# Altium schematic sheet Sheet1.SchDoc
size A4; SheetNumber: 1; SheetTotal: 1
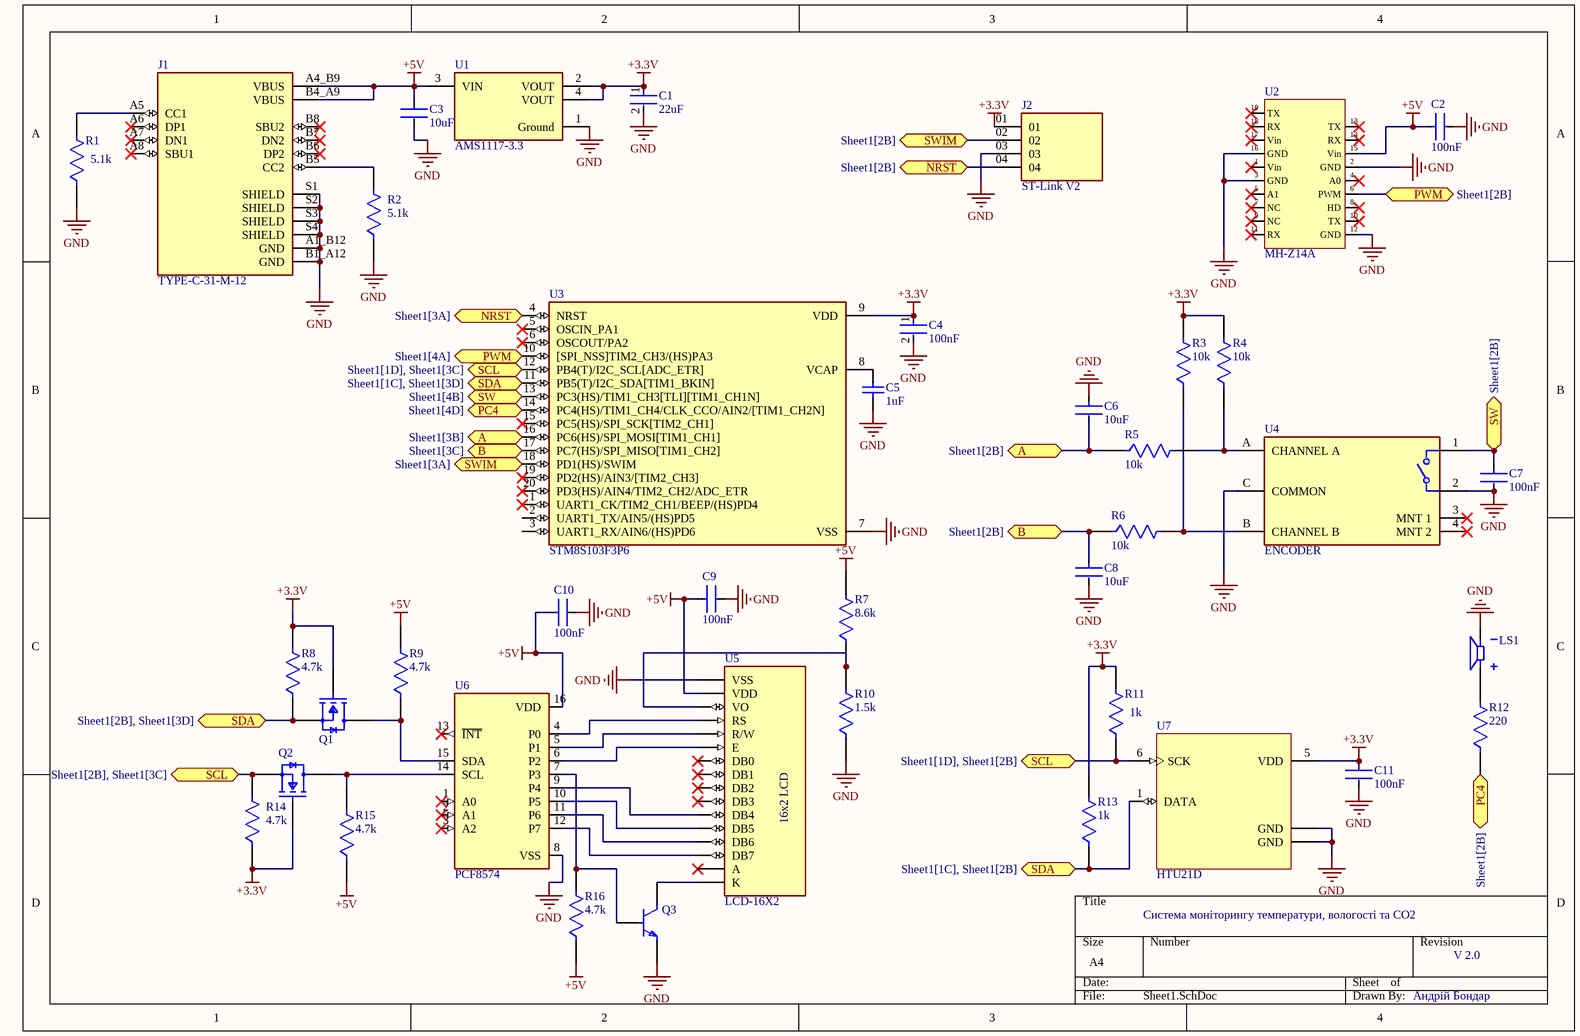
[diagram p0: Sheet1.SchDoc]

## Parts
C1  22uF  [FP-CGA5L-0_3-0_1-MFG]
C2  100nF  [FP-AC1206-0_85-MFG]
C3  10uF  [FP-C3216-160-0_2-IPC_B]
C4  100nF  [FP-AC1206-0_85-MFG]
C5  1uF  [CAPC1206(3216)150_L]
C6  10uF  [FP-C3216-160-0_2-IPC_B]
C7  100nF  [FP-AC1206-0_85-MFG]
C8  10uF  [FP-C3216-160-0_2-IPC_B]
C9  100nF  [FP-AC1206-0_85-MFG]
C10  100nF  [FP-AC1206-0_85-MFG]
C11  100nF  [FP-AC1206-0_85-MFG]
J1  TYPE-C-31-M-12  [HRO_TYPE-C-31-M-12]
J2  ST-Link V2  [SAMTEC_MTSW-104-07-G-S-200]
LS1  CPI-148-24-90T-67  [XDCR_CPI-148-24-90T-67]  (value not drawn)
Q1  BSS138  [FP-318-08-IPC_B]  (value not drawn)
Q2  BSS138  [FP-318-08-IPC_B]  (value not drawn)
Q3  SS8050DBU  [FP-135AN-MFG]  (value not drawn)
R1  5.1k  [FP-ESR18-IPC_A]
R2  5.1k  [FP-ESR18-IPC_A]
R3  10k  [FP-SR1206-MFG]
R4  10k  [FP-SR1206-MFG]
R5  10k  [FP-SR1206-MFG]
R6  10k  [FP-SR1206-MFG]
R7  8.6k  [FP-RP732B-MFG]
R8  4.7k  [FP-CRCW1206-Pe3-IPC_A]
R9  4.7k  [FP-CRCW1206-Pe3-IPC_A]
R10  1.5k  [FP-RMCF1206-MFG]
R11  1k  [FP-RMCF1206-IPC_A]
R12  220  [FP-SR1206-MFG]
R13  1k  [FP-RMCF1206-IPC_A]
R14  4.7k  [FP-CRCW1206-Pe3-IPC_A]
R15  4.7k  [FP-CRCW1206-Pe3-IPC_A]
R16  4.7k  [FP-CRCW1206-Pe3-IPC_A]
U1  AMS1117-3.3  [FP-AMS1117-IPC_C]
U2  MH-Z14A  [MH-Z14A]
U3  STM8S103F3P6  [SOP65P640X120-20N]
U4  ENCODER  [FP-PEC11R-4115F-S0018-MFG]
U5  LCD-16X2  [MODULE_LCD-16X2]
U6  PCF8574  [SOP65P640X150-20N]
U7  HTU21D  [QFN100P300X300X100-7N]

## Ports
A (bidir, see Sheet1[2B]), A (bidir, see Sheet1[3B]), B (bidir, see Sheet1[2B]), B (bidir, see Sheet1[3C]), NRST (bidir, see Sheet1[2B]), NRST (bidir, see Sheet1[3A]), PC4 (bidir, see Sheet1[2B]), PC4 (bidir, see Sheet1[4D]), PWM (bidir, see Sheet1[2B]), PWM (bidir, see Sheet1[4A]), SCL (bidir, see Sheet1[1D], Sheet1[2B]), SCL (bidir, see Sheet1[1D], Sheet1[3C]), SCL (bidir, see Sheet1[2B], Sheet1[3C]), SDA (bidir, see Sheet1[1C], Sheet1[2B]), SDA (bidir, see Sheet1[1C], Sheet1[3D]), SDA (bidir, see Sheet1[2B], Sheet1[3D]), SW (bidir, see Sheet1[2B]), SW (bidir, see Sheet1[4B]), SWIM (bidir, see Sheet1[2B]), SWIM (bidir, see Sheet1[3A])

## Nets
+3.3V: C1.1 C4.1 C11.1 J2.01 Q1.1(G) Q2.1(G) R3.2 R4.2 R8.2 R11.2 R13.2 R14.1 U1.2(VOUT) U1.4(VOUT) U3.9(VDD) U7.5(VDD)
+5V: C2.1 C3.1 C9.1 C10.1 J1.A4_B9(VBUS) J1.B4_A9(VBUS) R7.2 R9.2 R15.1 R16.1 U1.3(VIN) U2.15(Vin) U5.2(VDD) U6.16(VDD)
GND: C1.2 C2.2 C3.2 C4.2 C5.1 C6.1 C7.2 C8.2 C9.2 C10.2 C11.2 J1.A1_B12(GND) J1.B1_A12(GND) J1.S1(SHIELD) J1.S2(SHIELD) J1.S3(SHIELD) J1.S4(SHIELD) J2.03 LS1.N Q3.1(E) R1.1 R2.1 R10.1 U1.1(Ground) U2.2(GND) U2.3(GND) U2.12(GND) U2.16(GND) U3.7(VSS) U4.2 U4.C(COMMON) U5.1(VSS) U6.8(VSS) U7.2(GND) U7.PAD(GND)
A: C6.2 R5.1 U3.16(PC6(HS)/SPI_MOSI[TIM1_CH1]) ; port A
B: C8.1 R6.1 U3.17(PC7(HS)/SPI_MISO[TIM1_CH2]) ; port B
NRST: J2.04 U3.4(NRST) ; port NRST
PC4: R12.1 U3.14(PC4(HS)/TIM1_CH4/CLK_CCO/AIN2/[TIM1_CH2N]) ; port PC4
PWM: U2.6(PWM) U3.10([SPI_NSS]TIM2_CH3/(HS)PA3) ; port PWM
SCL: Q2.2(S) R11.1 R14.2 U3.12(PB4(T)/I2C_SCL[ADC_ETR]) U7.6(SCK) ; port SCL
SDA: Q1.2(S) R8.1 R13.1 U3.11(PB5(T)/I2C_SDA[TIM1_BKIN]) U7.1(DATA) ; port SDA
SW: C7.1 U3.13(PC3(HS)/TIM1_CH3[TLI][TIM1_CH1N]) U4.1 ; port SW
SWIM: J2.02 U3.18(PD1(HS)/SWIM) ; port SWIM
NetC5_2: C5.2 U3.8(VCAP)
NetJ1_A5: J1.A5(CC1) R1.2
NetJ1_B5: J1.B5(CC2) R2.2
NetLS1_P: LS1.P R12.2
NetQ1_3: Q1.3(D) R9.1 U6.15(SDA)
NetQ2_3: Q2.3(D) R15.2 U6.14(SCL)
NetQ3_2: Q3.2(B) R16.2 U6.7(P3)
NetQ3_3: Q3.3(C) U5.16(K)
NetR3_1: R3.1 R6.2 U4.B(CHANNEL_B)
NetR4_1: R4.1 R5.2 U4.A(CHANNEL_A)
NetR7_1: R7.1 R10.2 U5.3(VO)
NetU5_4: U5.4(RS) U6.4(P0)
NetU5_5: U5.5(R/W) U6.5(P1)
NetU5_6: U5.6(E) U6.6(P2)
NetU5_11: U5.11(DB4) U6.9(P4)
NetU5_12: U5.12(DB5) U6.10(P5)
NetU5_13: U5.13(DB6) U6.11(P6)
NetU5_14: U5.14(DB7) U6.12(P7)

Not connected (* = marked no-connect by the designer): J1 A6(DP1)* A7(DN1)* A8(SBU1)* B6(DP2)* B7(DN2)* B8(SBU2)*; U2 1(Vin)* 4(A0)* 5(A1)* 7(NC)* 8(HD)* 9(NC)* 10(TX)* 11(RX)* 13(TX)* 14(RX)* 17(Vin)* 18(RX)* 19(TX)*; U3 1(UART1_CK/TIM2_CH1/BEEP/(HS)PD4)* 2(UART1_TX/AIN5/(HS)PD5) 3(UART1_RX/AIN6/(HS)PD6) 5(OSCIN_PA1)* 6(OSCOUT/PA2)* 15(PC5(HS)/SPI_SCK[TIM2_CH1])* 19(PD2(HS)/AIN3/[TIM2_CH3])* 20(PD3(HS)/AIN4/TIM2_CH2/ADC_ETR)*; U4 3(MNT_1)* 4(MNT_2)*; U5 7(DB0)* 8(DB1)* 9(DB2)* 10(DB3)* 15(A)*; U6 1(A0)* 2(A1)* 3(A2)* 13(~{INT})*

## Notes on the sheet
- Система моніторингу температури, вологості та CO2
- V 2.0
- Андрій Бондар
- (in symbol LCD-16X2) 16x2 LCD

## Library data of the parts
C1 = CMP-08246-002069-1: Cap Ceramic 22uF 6.3V X7R 20% Pad SMD 1206 +125°C Automotive T/R; Min Operating Temperature: -55°C; Case/Package: 1206; Length: 3.2mm; Case Code (Metric): 3216; Termination: SMD/SMT; Package Quantity: 1; Packaging: Tape and Reel; REACH SVHC: No SVHC; Mount: Surface Mount; Width: 0.063inch; Weight: 0.000571oz; Thickness: 0.063inch; Capacitance: 22uF; Voltage Rating: 6.3V; Lead Free: Lead Free; Dielectric: X7R; Depth: 1.6mm; Case Code (Imperial): 1206; Composition: Ceramic; Height: 1.3mm; Tolerance: 20%; Voltage Rating (DC): 6.3V; Ratings: AEC-Q200; Max Operating Temperature: 125°C
C2 C4 C7 C9-C11 = CMP-03422-001145-1: CAP CER 0.1UF 100V X7R 1206; Manufacturer Part Number: AC1206KKX7R0BB104; Manufacturer: Yageo; Material: Ceramic; Temperature Coefficient: 15%; Tolerance: 0.1; Automotive Grade: Grade 1; Category: Cap; Temperature Characteristic: X7R; Height: 0.95mm; Automotive: Yes; Digikey Description: CAP CER 0.1UF 100V X7R 1206; Voltage Rating: 100 V; Octopart: https://octopart.com/ac1206kkx7r0bb104-yageo-75666120; ComponentLink2URL: http://www.yageo.com/documents/recent/UPY-AC_NP0X7R_16V-to-630V_12.pdf; Device Class L1: Passive Components; ComponentLink2Description: Datasheet; Footprint Url: http://www.yageo.com/exep/pages/download/literatures/UPY-C_GEN_24.pdf; Lead Free: Yes; Ipc Land Pattern Name: CAPC320160X85; Device Class L3: Ceramic Capacitors; Device Class L2: Capacitors; Value: 100 nF; Capacitance: 100 nF; RoHS: TRUE; Temperature Range Low: -55°C; Temperature: -55°C to +125°C; Temperature Range High: +125°C; Package: AC1206-0.85
C3 C6 C8 = CMP-08246-003840-1: Multilayer Ceramic Capacitors 10uF ±20% 25V X7R SMD 1206; Package Quantity: 2000; Dielectric Material: Ceramic; RoHS Compliant: Yes; Construction: Flat; Thickness: 0.075inch; Termination: SMD/SMT; Number of Pins: 2; Dielectric: X7R; Resistor Type: Ceramic; Series: C; Case/Package: 1206; Width: 0.063inch; Case Code (Imperial): 1206; Max Operating Temperature: 125°C; Lead Free: Lead Free; Radiation Hardening: No; Height: 1.6mm; Capacitance: 10uF; Voltage Rating: 25V; Mount: Surface Mount; Weight: 0.000571oz; Tolerance: 20%; Case Code (Metric): 3216; Min Operating Temperature: -55°C; Voltage Rating (DC): 25V; Packaging: Tape and Reel; Depth: 1.6mm; Length: 3.2mm
C5 = CMP-1037-04691-1: CAP 1uF 16V ±20% 1206 (3216 Metric) Thickness 1.45mm SMD; Case-EIA: 1206; Tolerance: Â±20%; Case-Metric: 3216; Rated Voltage: 16 V; Technology: SMT; Value: 1uF; Max Thickness: 1.45 mm
J1 = TYPE-C-31-M-12: USB Connectors 24 Receptacle 1 8.94*7.3mm RoHS; MF: HRO Electronics Co., Ltd.; SnapEDA_Link: https://www.snapeda.com/parts/TYPE-C-31-M-12/HRO+Electronics+Co.%252C+Ltd./view-part/?ref=snap; Package: Package; Value: *; MP: TYPE-C-31-M-12; Check_prices: https://www.snapeda.com/parts/TYPE-C-31-M-12/HRO+Electronics+Co.%252C+Ltd./view-part/?ref=eda
J2 = MTSW-104-07-G-S-200: MP: MTSW-104-07-G-S-200; Price: None; Availability: Unavailable; Package: None; Value: *
LS1 = CPI-148-24-90T-67: 13,9 Ð¼Ð¼, 24 Ð’ Ð¿Ð¾ÑÑ‚. Ñ‚Ð¾ÐºÐ°, 90 Ð´Ð‘, ÑÐºÐ²Ð¾Ð·Ð½Ð¾Ðµ Ð¾Ñ‚Ð²ÐµÑ€ÑÑ‚Ð¸Ðµ, Ð¿ÑŒÐµÐ·Ð¾ÑÐ»ÐµÐºÑ‚Ñ€Ð¸Ñ‡ÐµÑÐºÐ¸Ð¹ Ð·Ð²ÑƒÐºÐ¾Ð²Ð¾Ð¹ Ð¸Ð½Ð´Ð¸ÐºÐ°Ñ‚Ð¾Ñ€; MF: Same Sky; SnapEDA_Link: https://www.snapeda.com/parts/CPI-148-24-90T-67/Same+Sky/view-part/?ref=snap; Package: None; Value: *; MP: CPI-148-24-90T-67; Check_prices: https://www.snapeda.com/parts/CPI-148-24-90T-67/Same+Sky/view-part/?ref=eda
Q1 Q2 = CMP-07173-000101-1: MOSFET N-CH 50V 220MA SOT-23; Turn-Off Delay Time: 20ns; Element Configuration: Single; Rds On Max: 3.5R; Gate to Source Voltage (Vgs): 20V; Threshold Voltage: 1.3V; Number of Elements: 1; Power Dissipation: 360mW; Rise Time: 9ns; Turn-On Delay Time: 2.5ns; Input Capacitance: 27pF; On-State Resistance: 6R; Lead Free: Lead Free; Length: 2.92mm; Width: 1.3mm; Drain to Source Breakdown Voltage: 50V; Min Operating Temperature: -55°C; REACH SVHC: No SVHC; Packaging: Tape and Reel; Radiation Hardening: No; Height: 0.93mm; Drain to Source Voltage (Vdss): 50V; Current Rating: 220mA; Voltage Rating (DC): 50V; Weight: 0.03g; Continuous Drain Current (ID): 220mA; Number of Pins: 3; Nominal Vgs: 1.3V; Max Power Dissipation: 360mW; Fall Time: 9ns; Drain to Source Resistance: 3.5R; Contact Plating: Tin; Case/Package: SOT-23; Package Quantity: 1; Dual Supply Voltage: 50V; Mount: Surface Mount; Termination: SMD/SMT; Max Operating Temperature: 150°C
Q3 = CMP-00278-84331634-1: SS8050DBU Bipolar (BJT) Single Transistor, NPN, 25 V, 100 MHz, 1 W, 1.5 A, 160; Manufacturer Lifecycle Status: ACTIVE; Collector Base Voltage (VCBO): 40V; Power Dissipation: 1W; Max Junction Temperature (Tj): 150°C; Frequency: 100MHz; Output Power: 2W; Collector Emitter Voltage (VCEO): 25V; Max Collector Current: 1.5A; Collector Emitter Saturation Voltage: 500mV; Number of Elements: 1; Emitter Base Voltage (VEBO): 6V; hFE Min: 85; RoHS: Compliant; Lifecycle Status: Production; Lead Free: Lead Free; Transition Frequency: 100MHz; Case/Package: TO-92; Width: 3.86mm; Min Operating Temperature: -65°C; Element Configuration: Single; Gain Bandwidth Product: 100MHz; REACH SVHC: No SVHC; Max Frequency: 100MHz; Radiation Hardening: No; Current Rating: 1.5A; Mount: Through Hole; Max Operating Temperature: 150°C; Polarity: NPN; Number of Pins: 3; Collector Emitter Breakdown Voltage: 25V; Schedule B: 8541290080, 8541290080; Packaging: Bulk; Weight: 179mg; NexarPartId: 84331634; Voltage Rating (DC): 25V; Max Power Dissipation: 1W; Height: 4.58mm; Length: 4.58mm
R1 R2 = CMP-08839-028234-1: 5.1kΩ ±1% 0.5W 1206 Anti-Surge Chip Resistor AEC-Q200; Temperature Coefficient: 100ppm/°C; Max Power Dissipation: 333mW; Resistance: 5.1kR; Resistor Type: Thick Film; Max Operating Temperature: 155°C; Min Operating Temperature: -55°C; Features: Automotive AEC-Q200; Height: 0.026inch; Length: 0.126inch; Packaging: Tape and Reel; Width: 0.063inch; Case/Package: 1206; Tolerance: 1%; Series: ESR18; Number of Terminations: 2; RoHS Compliant: Yes; Package Quantity: 5000
R3-R6 = CMP-03412-033202-1: RES 10K OHM 1% 1/2W 1206; Manufacturer Part Number: SR1206FR-7W10KL; Manufacturer: Yageo; Power Rating: 0.5W; Automotive Grade: Grade 0; Voltage Rating: 200V; Resistance: 10KΩ; Value: 10KΩ; Tolerance: 0.01; Octopart: https://octopart.com/sr1206fr-7w10kl-yageo-92673874; ComponentLink2Description: Datasheet; Category: Res; Footprint Url: http://www.yageo.com/exep/pages/download/literatures/PYu-R_Mount_10.pdf; Height: 0.65mm; Composition: Thick Film; Device Class L2: Resistors; Device Class L1: Passive Components; Series: SR; Ipc Land Pattern Name: RESC310160X55; Temperature Range Low: -55°C; Digikey Description: RES 10K OHM 1% 1/2W 1206; Package: SR1206; Device Class L3: Chip SMD Resistors; Automotive: Yes; Temperature: -55°C to +155°C; Lead Free: Yes; RoHS: TRUE; ComponentLink2URL: http://www.yageo.com/documents/recent/PYu-SR_D_F%20tol_RoHS_L_3.pdf; Temperature Range High: +155°C
R7 = CMP-03211-003095-1: Res Thin Film 1206 8.66KΩ 0.1% 0.25W 15ppm/°C Molded SMD; Manufacturer: TE Connectivity; Manufacturer Part Number: RP73D2B8K66BTDF; Voltage Rating: 200V; Temperature Range Low: -55°C; Temperature: -55°C to 155°C; Package: RP732B; Device Class L1: Passive Components; Value: 8.66KΩ; packaging: 1000 Reel; Temperature Coefficient: 15ppm/°C; Automotive: No; Resistance: 8.66KΩ; Category: Res; Power Rating: 0.25W; Composition: Thin Film; Ipc Land Pattern Name: RESC305155X55; Tolerance: 0.1%; Octopart: https://octopart.com/rp73d2b8k66btdf-te+connectivity-22741248; Device Class L2: Resistors; octopart_url: https://octopart.com/rp73d2b8k66btdf-te+connectivity-22741248; ComponentLink2Description: Datasheet; RoHS: TRUE; Height: 0.65mm; Series: RP73; Device Class L3: Chip SMD Resistors; Temperature Range High: 155°C; Lead Free: Yes; ComponentLink2URL: https://www.te.com/commerce/DocumentDelivery/DDEController?Action=showdoc&DocId=Data+Sheet%7F1773272%7FL%7Fpdf%7FEnglish%7FENG_DS_1773272_L.pdf%7F8-1879255-6
R8 R9 R14-R16 = CMP-03613-000093-1: RES Thick Film, 4.7kΩ, 1%, 0.25W, 50ppm/°C, 1206; Max Power Dissipation: 250mW; Resistance: 4.7kR; Height: 0.024inch; Series: CRCW-P; Resistor Type: Thick Film; Number of Terminations: 2; Contact Plating: Tin; Package Quantity: 5000; Packaging: Tape and Reel; RoHS Compliant: Yes; Military Standard: Not; Temperature Coefficient: 50ppm/°C; Length: 0.126inch; Max Operating Temperature: 155°C; Construction: Rectangular; Features: Automotive AEC-Q200; Width: 0.063inch; Radiation Hardening: No; Min Operating Temperature: -55°C; Tolerance: 1%; Depth: 1.6mm; Case/Package: 1206
R10 = CMP-26527-000167-1: 1.5kΩ ±1% 0.25W 1206 Thick Film Chip Resistor AEC-Q200 compliant; Resistance: 1.5kR; Power Rating: 250mW; Temperature Coefficient: 100ppm/°C; Max Operating Temperature: 155°C; Size Code: 1206; Case Code (Imperial): 1206; Contact Plating: Tin; Packaging: Tape and Reel; Tolerance: 1%; Length: 0.126inch; Max Power Dissipation: 250mW; Min Operating Temperature: -55°C; Height: 0.028inch; Number of Terminations: 2; Features: Automotive AEC-Q200; Case/Package: 1206; Case Code (Metric): 3216; Construction: Rectangular; Radiation Hardening: No; Lead Free: Lead Free; Military Standard: Not; Width: 0.063inch; Package Quantity: 1; RoHS Compliant: Yes; Mount: Surface Mount; Depth: 1.6mm; Series: RMCF; Resistor Type: Thick Film
R11 R13 = CMP-26527-006126-1: 1kΩ ±5% 0.25W 1206 Thick Film Chip Resistor AEC-Q200 compliant; Resistance: 1kR; Max Power Dissipation: 250mW; Temperature Coefficient: 200ppm/°C; Resistor Type: Thick Film; Height: 0.028inch; Max Operating Temperature: 155°C; Features: Automotive AEC-Q200; Case/Package: 1206; Mount: Surface Mount; Series: RMCF; Min Operating Temperature: -55°C; Packaging: Tape and Reel; Contact Plating: Tin; Length: 0.126inch; Number of Terminations: 2; Radiation Hardening: No; Width: 0.063inch; Case Code (Metric): 3216; Case Code (Imperial): 1206; RoHS Compliant: Yes; Tolerance: 5%
R12 = CMP-03412-006046-1: RES SMD 220 OHM 1% 1/2W 1206; Manufacturer Part Number: SR1206FR-7W220RL; Manufacturer: Yageo; Voltage Rating: 200V; Value: 220Ω; Power Rating: 0.5W; Automotive Grade: Grade 0; Tolerance: 0.01; Lead Free: Yes; Category: Res; Footprint Url: http://www.yageo.com/exep/pages/download/literatures/PYu-R_Mount_10.pdf; ComponentLink2URL: http://www.yageo.com/documents/recent/PYu-SR_D_F%20tol_RoHS_L_3.pdf; Octopart: https://octopart.com/sr1206fr-7w220rl-yageo-71414967; Height: 0.65mm; ComponentLink2Description: Datasheet; Temperature Range High: +155°C; Ipc Land Pattern Name: RESC310160X55; Resistance: 220Ω; Temperature Range Low: -55°C; Device Class L3: Chip SMD Resistors; Device Class L1: Passive Components; Composition: Thick Film; Package: SR1206; Series: SR; Device Class L2: Resistors; Temperature: -55°C to +155°C; RoHS: TRUE; Digikey Description: RES SMD 220 OHM 1% 1/2W 1206; Automotive: Yes
U1 = CMP-209535-000001-1: LDO Voltage Regulators 1A, 3.3V; Manufacturer: Advanced Monolithic Systems; Dropout Voltage: 1.1V; Output Type: Fixed; Nominal Supply Current: 5mA; Max Power Dissipation: 1.2W; Max Supply Voltage: 15V; Number Of Outputs: 1; Standoff Height: 0.64mm; Max Junction Temp: +125°C; Height: 1.8mm; Package: AMS1117; Device Class L2: Power Management ICs; ComponentLink2Description: Datasheet; ComponentLink2URL: http://www.advanced-monolithic.com/pdf/ds1117.pdf; Category: IC; RoHS: TRUE; Automotive: No; Device Class L1: Integrated Circuits (ICs); Output Current: 1A; Device Class L3: Voltage Regulators - Linear; Temperature: -40°C to +125°C; Output Voltage: 3.3V; Manufacturer Part Number: AMS1117-3.3; Temperature Range Low: -40°C; Octopart: https://octopart.com/ams1117-3.3-advanced+monolithic+systems-25899300; Lead Free: Yes; Ipc Land Pattern Name: SOT229P700X180-4; Temperature Range High: +125°C
U3 = STM8S103F3P6: STM8 series Microcontroller IC 8-Bit 16MHz 8KB (8K x 8) FLASH 20-TSSOP; MF: STMicroelectronics; SnapEDA_Link: https://www.snapeda.com/parts/STM8S103F3P6/STMicroelectronics/view-part/?ref=snap; Package: TSSOP-20 STMicroelectronics; Value: *; MP: STM8S103F3P6; Check_prices: https://www.snapeda.com/parts/STM8S103F3P6/STMicroelectronics/view-part/?ref=eda
U4 = CMP-07421-000064-1: ROTARY ENCODER MECHANICAL 18PPR; Hole Diameter: 1.8mm; Output Type: Quadrature; Number of Channels: 2; Detent: Yes; Pulses per Revolution: 18; Height: 13.4mm; Min Operating Temperature: -30°C; Radiation Hardening: No; Series: PEC11R; Max Operating Temperature: 70°C; Package Quantity: 150; Built in Switch: Yes; Mount: Through Hole; Packaging: Bulk; Termination: PC Pins; Number of Pins: 5; REACH SVHC: No SVHC; Width: 12.5mm; Encoder Type: Mechanical; Length: 21.5mm; RoHS Compliant: Yes; Orientation: Vertical
U5 = LCD-16X2: Display Development Tools 16x2 Black on Green Char LCD w Backlight; MF: Gravitech; SnapEDA_Link: https://www.snapeda.com/parts/LCD-16X2/Gravitech/view-part/?ref=snap; Package: None; Value: *; MP: LCD-16X2; Check_prices: https://www.snapeda.com/parts/LCD-16X2/Gravitech/view-part/?ref=eda
U6 = PCF8574: I/O Expander 8 IÂ²C 100 kHz 20-VQFN (3.5x4.5); MF: Texas Instruments; SnapEDA_Link: https://www.snapeda.com/parts/PCF8574/Texas+Instruments/view-part/?ref=snap; Package: VFQFN-16 Texas Instruments; Value: *; MP: PCF8574; Check_prices: https://www.snapeda.com/parts/PCF8574/Texas+Instruments/view-part/?ref=eda
U7 = HTU21D: Humidity Temperature Sensor 0 ~ 100% RH IÂ²C Â±2% RH 5s Surface Mount; MF: TE Connectivity; SnapEDA_Link: https://www.snapeda.com/parts/HTU21D/TE%20Connectivity%20ALCOSWITCH%20Switches/view-part/562219/?ref=snap; Availability: Unavailable; TE_purchase_URL: https://www.te.com/usa-en/product-CAT-HSC0004.html?te_bu=Cor&te_type=disp&te_campaign=seda_glo_cor-seda-global-disp-prtnr-fy19-seda-model-bom-cta_sma-317_1&elqCampaignId=32493; Value: *; Price: None; MP: HTU21D; Package: DFN-6 TE Connectivity; ComponentLink1Description: New link; ComponentLink1URL: *